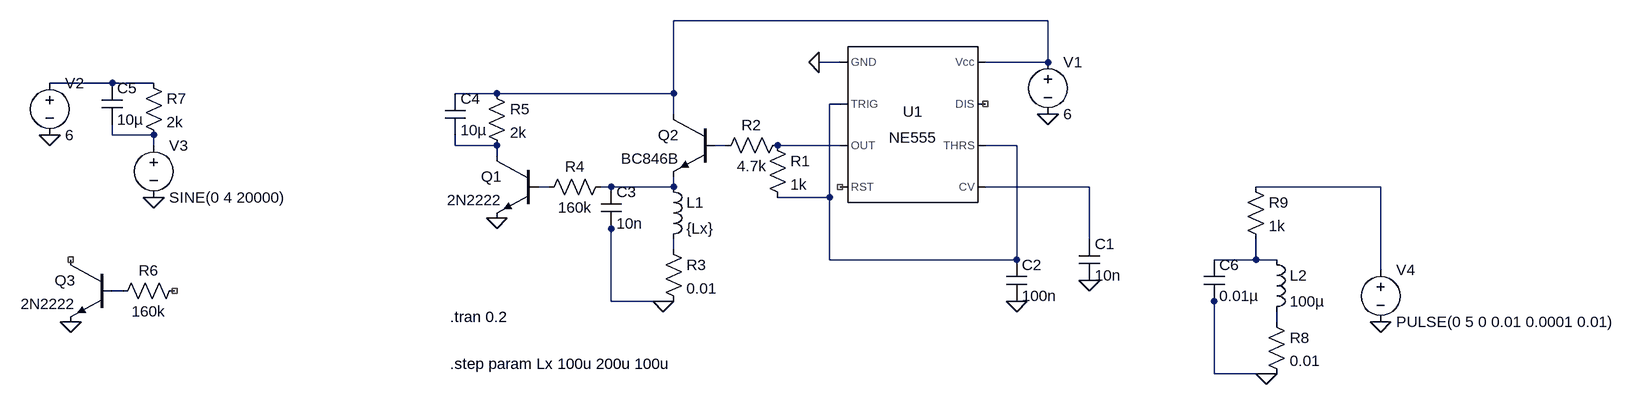
[diagram p0: schematic cxem2.asc]
cxem2.asc, the LTspice schematic file:
Version 4
SHEET 1 1532 680
WIRE 592 -16 16 -16
WIRE 272 48 240 48
WIRE 592 48 592 -16
WIRE 592 48 496 48
WIRE -848 80 -944 80
WIRE -784 80 -848 80
WIRE -256 96 -320 96
WIRE 16 96 16 -16
WIRE 16 96 -256 96
WIRE 272 112 256 112
WIRE 16 128 16 96
WIRE -848 160 -848 144
WIRE -784 160 -848 160
WIRE -784 176 -784 160
WIRE -320 176 -320 160
WIRE -256 176 -320 176
WIRE 96 176 80 176
WIRE 272 176 176 176
WIRE 544 176 496 176
WIRE -256 192 -256 176
WIRE -176 240 -192 240
WIRE -80 240 -96 240
WIRE 16 240 16 224
WIRE 16 240 -80 240
WIRE 656 240 496 240
WIRE 1104 240 912 240
WIRE 256 256 256 112
WIRE 256 256 176 256
WIRE -80 304 -80 288
WIRE 656 320 656 240
WIRE 16 336 16 320
WIRE 256 352 256 256
WIRE 544 352 544 176
WIRE 544 352 256 352
WIRE 912 352 912 320
WIRE 912 352 848 352
WIRE 944 352 912 352
WIRE 1104 368 1104 240
WIRE -832 400 -848 400
WIRE -80 416 -80 304
WIRE 0 416 -80 416
WIRE 16 416 0 416
WIRE 848 416 848 400
WIRE 944 448 944 432
WIRE 848 528 848 416
WIRE 928 528 848 528
WIRE 944 528 928 528
FLAG 240 48 0
FLAG 656 384 0
FLAG 544 416 0
FLAG 592 128 0
FLAG 0 416 0
FLAG -256 288 0
FLAG -912 448 0
FLAG -944 160 0
FLAG -784 256 0
FLAG 928 528 0
FLAG 1104 448 0
SYMBOL Misc\\NE555 384 144 R0
SYMATTR InstName U1
SYMBOL npn -192 192 M0
SYMATTR InstName Q1
SYMATTR Value 2N2222
SYMBOL npn 80 128 M0
SYMATTR InstName Q2
SYMATTR Value BC846B
SYMBOL voltage 592 32 R0
WINDOW 123 0 0 Left 0
WINDOW 39 0 0 Left 0
SYMATTR InstName V1
SYMATTR Value 6
SYMBOL cap 640 320 R0
SYMATTR InstName C1
SYMATTR Value 10n
SYMBOL cap 528 352 R0
SYMATTR InstName C2
SYMATTR Value 100n
SYMBOL res 160 160 R0
SYMATTR InstName R1
SYMATTR Value 1k
SYMBOL res 192 160 R90
WINDOW 0 0 56 VBottom 2
WINDOW 3 32 56 VTop 2
SYMATTR InstName R2
SYMATTR Value 4.7k
SYMBOL res 0 320 R0
SYMATTR InstName R3
SYMATTR Value 0.01
SYMBOL res -80 224 R90
WINDOW 0 0 56 VBottom 2
WINDOW 3 32 56 VTop 2
SYMATTR InstName R4
SYMATTR Value 160k
SYMBOL res -272 80 R0
SYMATTR InstName R5
SYMATTR Value 2k
SYMBOL cap -96 240 R0
SYMATTR InstName C3
SYMATTR Value 10n
SYMBOL cap -336 96 R0
SYMATTR InstName C4
SYMATTR Value 10µ
SYMBOL ind 0 224 R0
SYMATTR InstName L1
SYMATTR Value {Lx}
SYMBOL npn -848 352 M0
SYMATTR InstName Q3
SYMATTR Value 2N2222
SYMBOL res -736 384 R90
WINDOW 0 0 56 VBottom 2
WINDOW 3 32 56 VTop 2
SYMATTR InstName R6
SYMATTR Value 160k
SYMBOL res -800 64 R0
SYMATTR InstName R7
SYMATTR Value 2k
SYMBOL cap -864 80 R0
SYMATTR InstName C5
SYMATTR Value 10µ
SYMBOL voltage -944 64 R0
WINDOW 123 0 0 Left 0
WINDOW 39 0 0 Left 0
SYMATTR InstName V2
SYMATTR Value 6
SYMBOL voltage -784 160 R0
WINDOW 123 0 0 Left 0
WINDOW 39 0 0 Left 0
SYMATTR InstName V3
SYMATTR Value SINE(0 4 20000)
SYMBOL res 928 432 R0
SYMATTR InstName R8
SYMATTR Value 0.01
SYMBOL ind 928 336 R0
SYMATTR InstName L2
SYMATTR Value 100µ
SYMBOL cap 832 352 R0
SYMATTR InstName C6
SYMATTR Value 0.01µ
SYMATTR SpiceLine V=6.3 Irms=0 Rser=0 Lser=0 mfg="Murata" pn="GRM033R70J103KA01" type="X7R"
SYMBOL voltage 1104 352 R0
WINDOW 123 0 0 Left 0
WINDOW 39 0 0 Left 0
SYMATTR InstName V4
SYMATTR Value PULSE(0 5 0 0.01 0.0001 0.01)
SYMBOL res 896 224 R0
SYMATTR InstName R9
SYMATTR Value 1k
TEXT -328 440 Left 2 !.tran 0.2
TEXT -328 512 Left 2 !.step param Lx 100u 200u 100u

The netlist it stands for:
* cxem2.asc
XU1 0 N003 N007 NC_01 N010 N003 NC_02 N001 NE555  ; pins GND TRIG OUT RST CV THRS DIS Vcc
Q1 N005 N008 0 0 2N2222
Q2 N001 N006 N009 0 BC846B
V1 N001 0 6
C1 N010 0 10n
C2 N003 0 100n
R1 N007 N003 1k
R2 N007 N006 4.7k
R3 N012 0 0.01
R4 N009 N008 160k
R5 N001 N005 2k
C3 N009 0 10n
C4 N001 N005 10µ
L1 N009 N012 {Lx}
Q3 NC_03 N014 0 0 2N2222
R6 NC_04 N014 160k
R7 N002 N004 2k
C5 N002 N004 10µ
V2 N002 0 6
V3 N004 0 SINE(0 4 20000)
R8 N015 0 0.01
L2 N013 N015 100µ
C6 N013 0 0.01µ V=6.3 Irms=0 Rser=0 Lser=0 mfg="Murata" pn="GRM033R70J103KA01" type="X7R"
V4 N011 0 PULSE(0 5 0 0.01 0.0001 0.01)
R9 N011 N013 1k
.model NPN NPN
.model PNP PNP
.lib standard.bjt
.tran 0.2
.step param Lx 100u 200u 100u
.lib NE555.sub
.backanno
.end